# Altium schematic sheet BoardGestalt.SchDoc
size A4; Organization: Altium Limited; Address1: L3, 12a Rodborough Rd; Address2: Frenchs Forest; Address3: NSW; Address4: Australia 2086
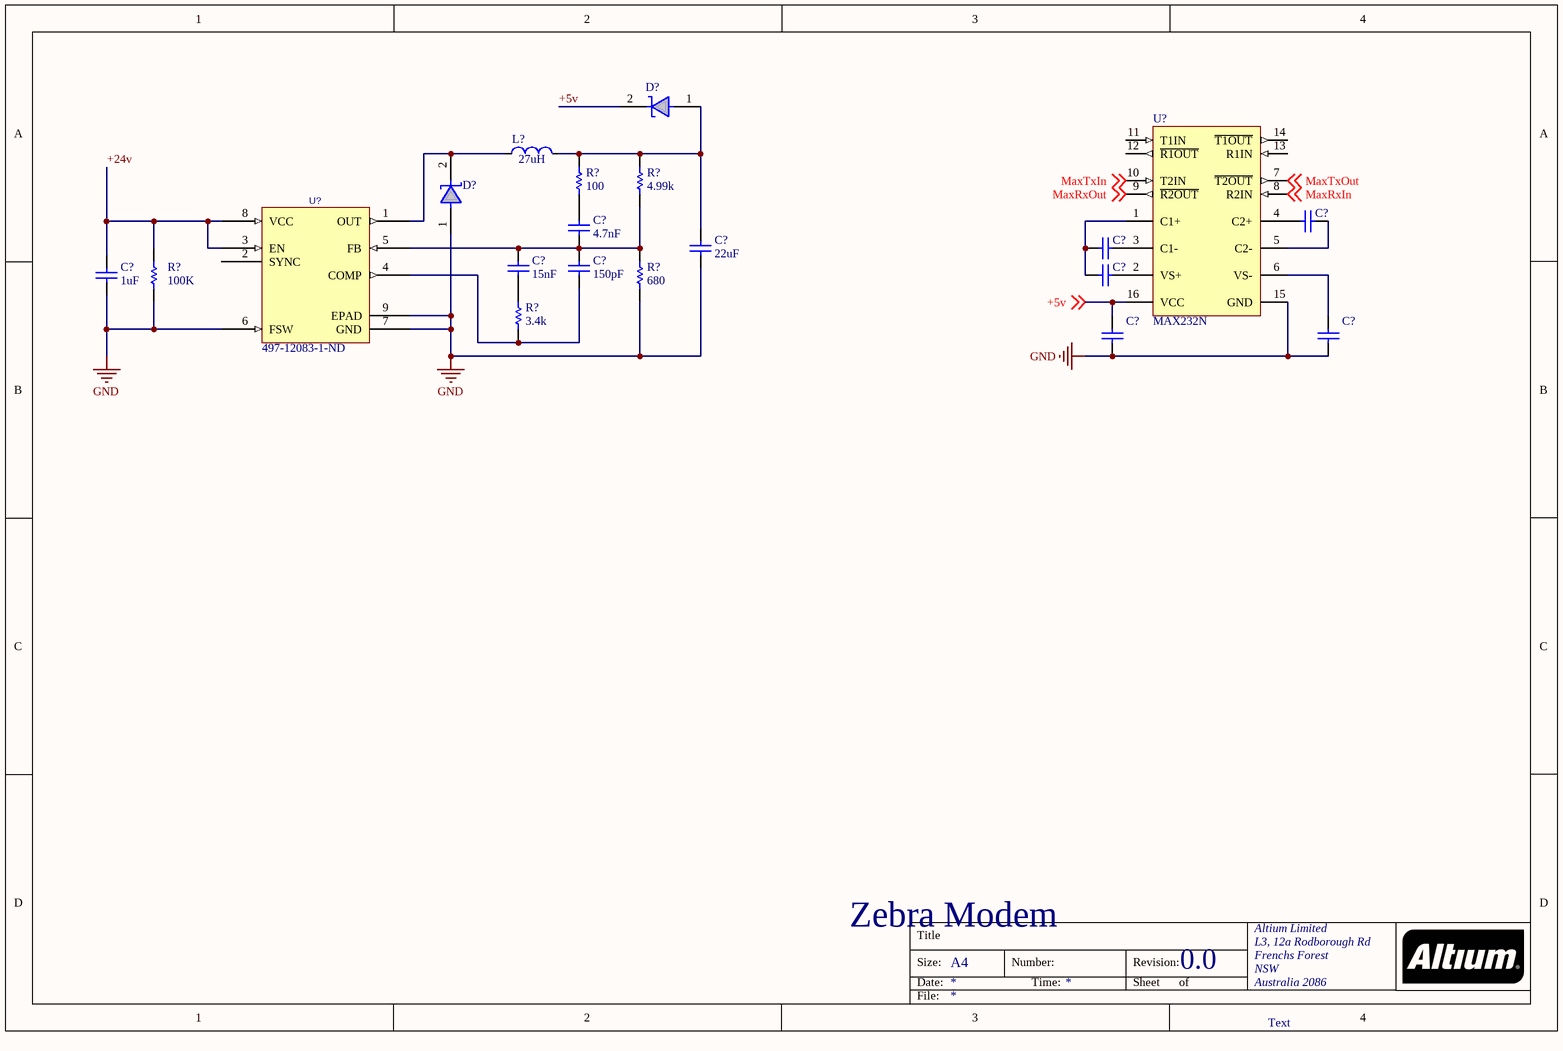
[diagram p0: BoardGestalt.SchDoc]

## Parts
(Parts that share a designator on the sheet are numbered #1, #2 ... from top to bottom, then left to right.)
C?#1  CAP_1_21_4  [0402]  (value not drawn)
C?#2  value 4.7nF  [0603]  (hidden comment: CAP_2)
C?#3  CAP_1_21_4  [0402]  (value not drawn)
C?#4  value 22uF  [0603]  (hidden comment: CAP_1_25)
C?#5  CAP_1_21_4  [0402]  (value not drawn)
C?#6  value 15nF  [0603]  (hidden comment: CAP_1_17)
C?#7  value 150pF  [0402]  (hidden comment: CAP_1_16)
C?#8  value 1uF  [0402]  (hidden comment: CAP_1_21_3)
C?#9  CAP_1_21_4  [0402]  (value not drawn)
C?#10  CAP_1_21_4  [0402]  (value not drawn)
D?#1  SCHOTTKY DIODE  [SOD323]  (value not drawn)
D?#2  SCHOTTKY DIODE  [SOD323]  (value not drawn)
L?  Inductance: 27uH  [0603]  (hidden comment: INDUCTOR)
R?#1  value 100  [0603]  (hidden comment: RES_9)
R?#2  value 4.99k  [0402]  (hidden comment: RES_38)
R?#3  value 100K  [0402]  (hidden comment: RES_11)
R?#4  value 680  [0402]  (hidden comment: RES_49)
R?#5  value 3.4k  [0603]  (hidden comment: RES_32)
U?#1  MAX232N  [TI-N16]
U?#2  Supplier Part Number 1: 497-12083-1-ND  [L7986ATR]  (hidden comment: L7986ATR)

## Nets
GND: C?#4.1 C?#8.1 C?#9.1 C?#10.1 D?#2.1(A) R?#3.2 R?#4.1 U?#1.15(GND) U?#2.6(FSW) U?#2.7(GND) U?#2.9(EPAD)
+5v: C?#9.2 D?#1.2(K) U?#1.16(VCC) ; off-sheet +5v
+24v: C?#8.2 R?#3.1 U?#2.3(EN) U?#2.8(VCC)
MaxRxIn: U?#1.8(R2IN) ; off-sheet MaxRxIn
MaxRxOut: U?#1.9(~{R2OUT}) ; off-sheet MaxRxOut
MaxTxIn: U?#1.10(T2IN) ; off-sheet MaxTxIn
MaxTxOut: U?#1.7(~{T2OUT}) ; off-sheet MaxTxOut
NetC?#1_1: C?#1.1 U?#1.4(C2+)
NetC?#1_2: C?#1.2 U?#1.5(C2-)
NetC?#2_1: C?#2.1 R?#1.1
NetC?#2_2: C?#2.2 C?#6.2 C?#7.2 R?#2.1 R?#4.2 U?#2.5(FB)
NetC?#3_1: C?#3.1 C?#5.1 U?#1.1(C1+)
NetC?#3_2: C?#3.2 U?#1.3(C1-)
NetC?#4_2: C?#4.2 D?#1.1(A) L?.2 R?#1.2 R?#2.2
NetC?#5_2: C?#5.2 U?#1.2(VS+)
NetC?#6_1: C?#6.1 R?#5.2
NetC?#7_1: C?#7.1 R?#5.1 U?#2.4(COMP)
NetC?#10_2: C?#10.2 U?#1.6(VS-)
NetD?#2_2: D?#2.2(K) L?.1 U?#2.1(OUT)

Not connected (* = marked no-connect by the designer): U?#1 11(T1IN) 12(~{R1OUT}) 13(R1IN) 14(~{T1OUT}); U?#2 2(SYNC)

## Notes on the sheet
- Zebra Modem
- 0.0
- Text
- Title
- Size:
- Date:
- A4
- Number:
- Time:
- Revision:
- Sheet
- of
- File:

## Library data of the parts
C?#1 C?#3 C?#5 C?#9 C?#10 = CAP_1_21_4: 1uF 10% 10V; Tolerance: 10%; Value: 1uF; Voltage: 10V
C?#2 = CAP_2: 4.7nF 10% 50V; Tolerance: 10%; Voltage: 50V
C?#4 = CAP_1_25: 22uF 20% 6.3V; Tolerance: 20%; Voltage: 6.3V
C?#6 = CAP_1_17: 15nF 10% 50V; Tolerance: 10%; Voltage: 50V
C?#7 = CAP_1_16: 150pF 5% 50V; Tolerance: 5%; Voltage: 50V
C?#8 = CAP_1_21_3: 1uF 10% 50V
R?#1 = RES_9: RES 100 0.1W ±1% 0603 (1608); Power: *; Tolerance: *
R?#2 = RES_38: RES 4.99K ±1% 0603 (1608); Power: *; Tolerance: *
R?#3 = RES_11: RES 100K 0.1W ±1% 0603 (1608 Metric)
R?#4 = RES_49: RES 680 ±1% 0603 (1608); Power: *; Tolerance: *
R?#5 = RES_32: RES 3.4K ±1% 0603 (1608); Power: *; Tolerance: *
U?#1 = MAX232N: Dual EIA-232 Driver / Receiver, 0 to 70 degC, 16-Pin PDIP (N), Pb-Free (RoHS); SubFamily: RS-232; Drivers Per Package: 2; Supply Voltage(s)(V): 5; ESD HBM(kV): +/-2; ICC(Max)(mA): 10; Single Supply: TRUE; DatasheetVersion: SLLS047L; PackageVersion: revE, Dec-2002; PackageReference: N16; PackageDescription: 16-Pin Plastic Dual-In-Line Package, Row Spacing 7.62 mm, Pitch 2.54 mm; Receivers Per Package: 2; RS-232: TRUE; ComponentLink1Description: Manufacturer URL; ComponentLink1URL: www.ti.com; ComponentLink2Description: Datasheet; ComponentLink2URL: http://www.ti.com/general/docs/lit/getliterature.tsp?genericPartNumber=MAX232&fileType=pdf; ComponentLink3Description: Package Specification; ComponentLink3URL: http://www.ti.com/litv/pdf/mpdi002c
U?#2 = L7986ATR: IC Switching Regulator 3A STEP-DOWN 8-HSOP; Title: L7986TATR; Supplier 1: Digi-Key
L? = INDUCTOR: Current: *; Resistance: *